# Altium project candy.PrjPcb
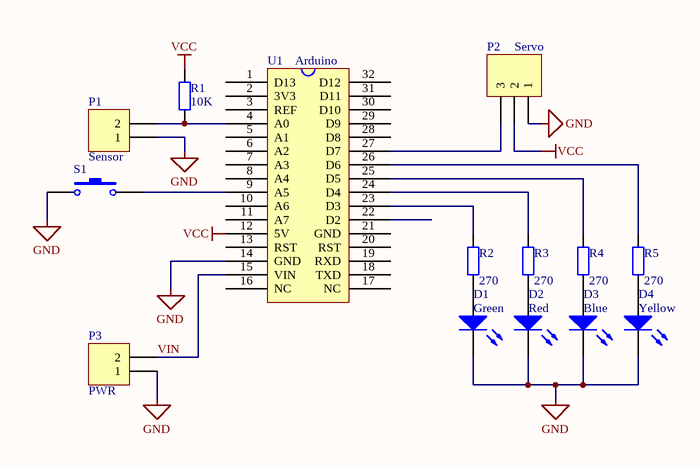
[diagram p0: Sheet1.SchDoc]
1 sheet, 14 parts. Net scope: global (net labels, ports and power ports of the same name join across sheets).
Board file: PCB1.PcbDoc

## Sheet Sheet1.SchDoc
size A4

### Parts
D1  Green  [LED_3mm]
D2  Red  [LED_3mm]
D3  Blue  [LED_3mm]
D4  Yellow  [LED_3mm]
P1  Sensor  [HDR1X2]
P2  Servo  [HDR1X3]
P3  PWR  [HDR1X2]
R1  value 10K  [AXIAL-0.3]  (hidden comment: Res2)
R2  value 270  [AXIAL-0.3]  (hidden comment: Res2)
R3  value 270  [AXIAL-0.3]  (hidden comment: Res2)
R4  value 270  [AXIAL-0.3]  (hidden comment: Res2)
R5  value 270  [AXIAL-0.3]  (hidden comment: Res2)
S1  SW-PB  [SW]  (value not drawn)
U1  Arduino  [Arduino_nano]

### Nets
GND: D1.2(K) D2.2(K) D3.2(K) D4.2(K) P1.1 P2.1 P3.1 S1.1 U1.14(GND)
VCC: P2.2 R1.2 U1.12(5V)
VIN: P3.2 U1.15(VIN)
NetD1_1: D1.1(A) R2.1
NetD2_1: D2.1(A) R3.1
NetD3_1: D3.1(A) R4.1
NetD4_1: D4.1(A) R5.1
NetP1_2: P1.2 R1.1 U1.4(A0)
NetP2_3: P2.3 U1.27(D7)
NetR2_2: R2.2 U1.23(D3)
NetR3_2: R3.2 U1.24(D4)
NetR4_2: R4.2 U1.25(D5)
NetR5_2: R5.2 U1.26(D6)
NetS1_2: S1.2 U1.9(A5)

Not connected (* = marked no-connect by the designer): U1 1(D13) 2(3V3) 3(REF) 5(A1) 6(A2) 7(A3) 8(A4) 10(A6) 11(A7) 13(RST) 16(NC) 17(NC) 18(TXD) 19(RXD) 20(RST) 21(GND) 22(D2) 28(D8) 29(D9) 30(D10) 31(D11) 32(D12)

### Library data of the parts
D1-D4 = LED0: Typical INFRARED GaAs LED; Published: 8-Jun-2000; LatestRevisionDate: 08-Jul-2005; LatestRevisionNote: Mech Layer 1 removed.; PackageReference: LED-0; Publisher: Altium Limited; PackageDescription: LED; 2 Leads
P1 P3 = Header 2: Header, 2-Pin; LatestRevisionDate: 17-Jul-2002; LatestRevisionNote: Re-released for DXP Platform.; Publisher: Altium Limited
P2 = Header 3: Header, 3-Pin; LatestRevisionDate: 17-Jul-2002; LatestRevisionNote: Re-released for DXP Platform.; Publisher: Altium Limited
R1-R5 = Res2: Resistor; Published: 8-Jun-2000; LatestRevisionDate: 17-Jul-2002; LatestRevisionNote: Re-released for DXP Platform.; PackageReference: AXIAL-0.4; Publisher: Altium Limited; PackageDescription: Axial Device, Thru-Hole; 2 Leads; 0.4 in Pin Spacing
S1 = SW-PB: Switch; Published: 24-Mar-1999; LatestRevisionDate: 17-Jul-2002; LatestRevisionNote: Re-released for DXP Platform.; PackageReference: SPST-2; Publisher: Altium Limited; PackageDescription: Switch; 2 Leads
U1 = Arduino_nano